# Altium schematic sheet Classes.SchDoc
size 431 x 279 mm; Organization: ORGANIZATION; Address1: ADDRESS 1; Address2: ADDRESS 2; Address3: ADDRESS 3; Address4: ADDRESS 4; Revision: -; SheetNumber: 2; SheetTotal: 2; ENG_APP_DATE: --/--/--; DSN_APP_DATE: --/--/--; CHK_APP_DATE: --/--/--
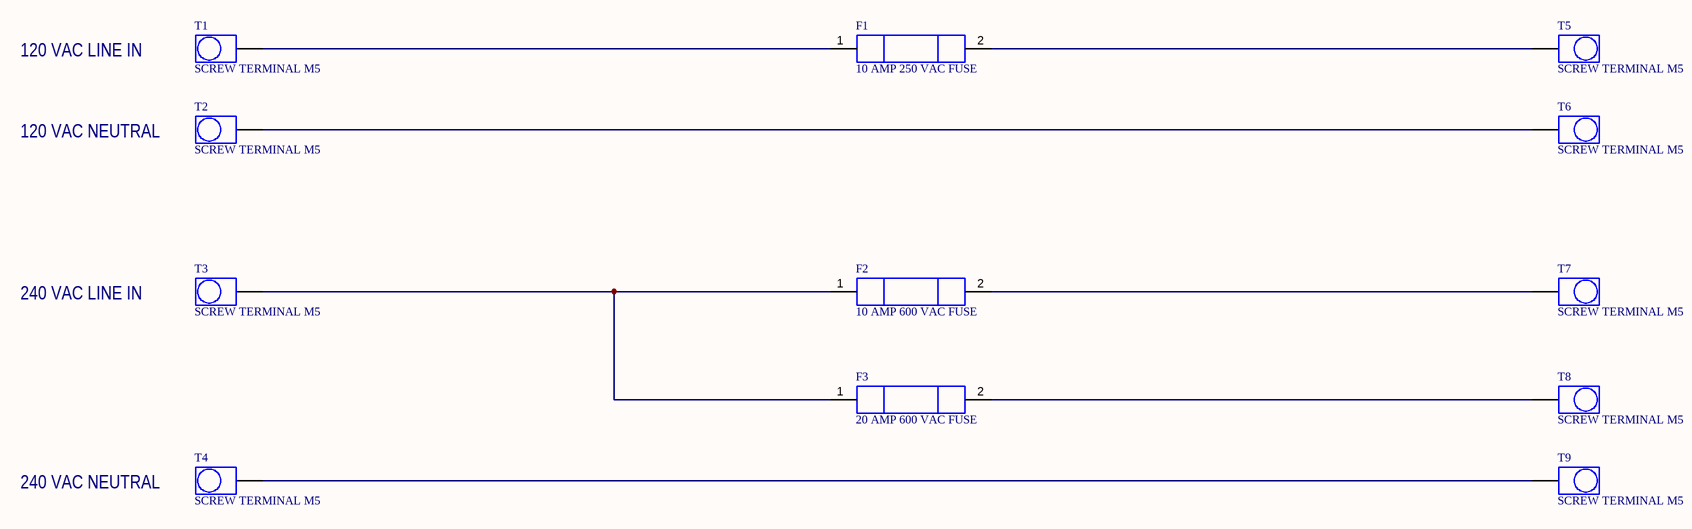
[diagram p0: Classes.SchDoc]

## Parts
F1  10 AMP 250 VAC FUSE  [FUSE]
F2  10 AMP 600 VAC FUSE  [FUSE]
F3  20 AMP 600 VAC FUSE  [FUSE]
T1  SCREW TERMINAL M5  [SCREW TERMINAL M5-Footprint]
T2  SCREW TERMINAL M5  [SCREW TERMINAL M5-Footprint]
T3  SCREW TERMINAL M5  [SCREW TERMINAL M5-Footprint]
T4  SCREW TERMINAL M5  [SCREW TERMINAL M5-Footprint]
T5  SCREW TERMINAL M5  [SCREW TERMINAL M5-Footprint]
T6  SCREW TERMINAL M5  [SCREW TERMINAL M5-Footprint]
T7  SCREW TERMINAL M5  [SCREW TERMINAL M5-Footprint]
T8  SCREW TERMINAL M5  [SCREW TERMINAL M5-Footprint]
T9  SCREW TERMINAL M5  [SCREW TERMINAL M5-Footprint]

## Nets
NetF1_1: F1.1 T1.1
NetF1_2: F1.2 T5.1
NetF2_1: F2.1 F3.1 T3.1
NetF2_2: F2.2 T7.1
NetF3_2: F3.2 T8.1
NetT2_1: T2.1 T6.1
NetT4_1: T4.1 T9.1

## Notes on the sheet
- 120 VAC LINE IN
- 120 VAC NEUTRAL
- 240 VAC LINE IN
- 240 VAC NEUTRAL
- DWG. NO.
- REV.
- SHT.
- THIS DOCUMENT AND THE DATA DISCLOSED HEREIN OR HEREWITH IS THE PROPERTY OF ALTIUM LIMITED AND MAY BE FREELY DISTRIBUTED IN WHOLE. NO RIGHTS ARE RESERVED OR EXPRESS OR IMPLIED WARANTEE GIVEN.
- REVISION
- DESCRIPTION
- DATE
- APPROVED
- ENG:
- DSN:
- APPROVALS
- PROJECT REVISION:
- www.altium.com <http://www.altium.com>
- DOCUMENT REVISION:
- 92037, La Jolla
- USA
- Altium Ltd.
- 4225 Executive Square
- CHK:
- REFERENCE DOCUMENTS
- DESIGN ITEM:
- TITLE
- VARIANT
- BOM:
- FAB DWG:
- PCB DWG:
- ASSY DWG:
- SCALE:
- SIZE
- B
- CAGE CODE
- FILE NAME
- DWG NO.
- SHEET
- OF
- REV

## Library data of the parts
F1 = CMP-005-00017-2: Current Rating: 10A; Voltage Rating: 250V; Case/Package: THT; Mounting Technology: THT; Pins: 2; ClassName: 120_VOLT
F2 = CMP-005-00018-1: Current Rating: 10A; Voltage Rating: 600V; Case/Package: THT; Mounting Technology: THT; Pins: 2; ClassName: 240_VOLT
F3 = CMP-005-00019-1: Current Rating: 20A; Voltage Rating: 600V; Case/Package: THT; Mounting Technology: THT; Pins: 2; ClassName: 240_VOLT
T1-T9 = CMP-002-00077-1: Max Current Rating: 100A; Voltage Rating: 600V; Case/Package: THT; Connector Type: SCREW TERMINAL M5; Mounting Technology: THT; Pins: 1
  T1-T4: ClassName: LEFT
  T5-T9: ClassName: RIGHT